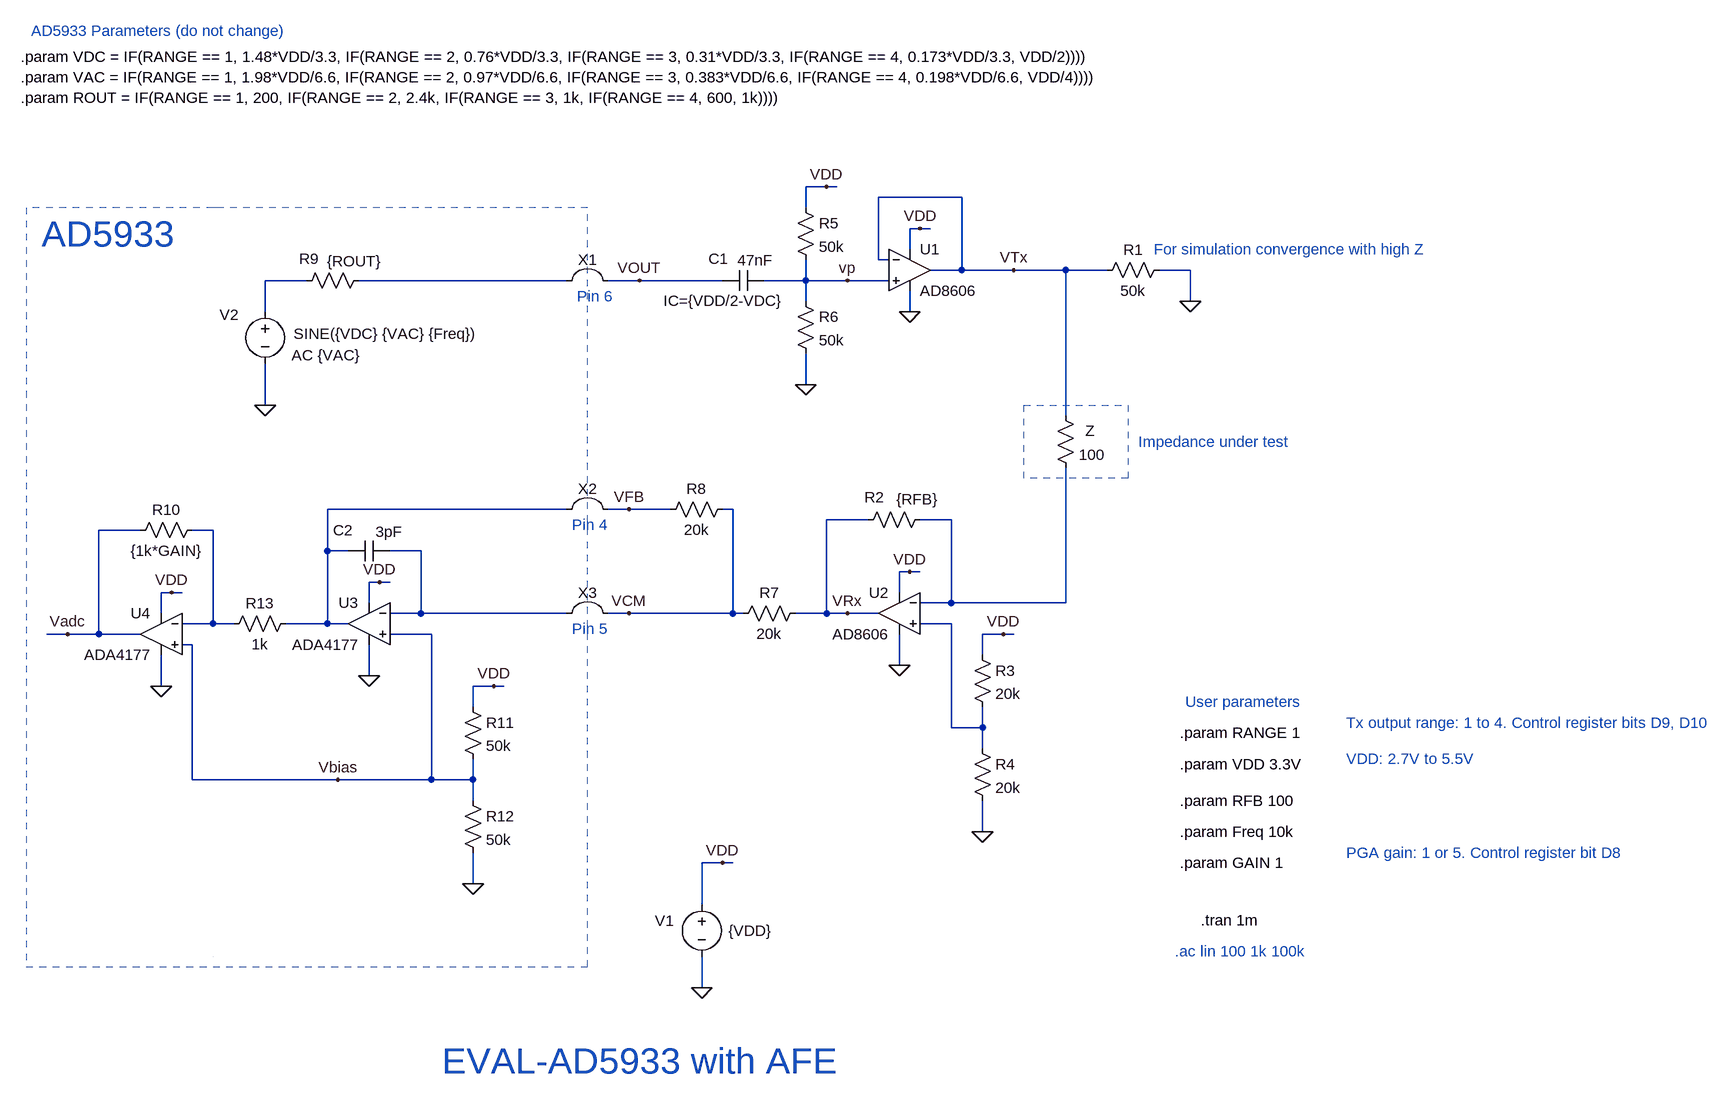
[diagram p0: schematic EVAL-AD5933.asc]
EVAL-AD5933.asc, the LTspice schematic file:
Version 4
SHEET 1 2608 1192
WIRE 80 -208 48 -208
WIRE 96 -208 80 -208
WIRE 288 -192 160 -192
WIRE 48 -176 48 -208
WIRE 224 -144 208 -144
WIRE 240 -144 224 -144
WIRE 208 -112 208 -144
WIRE 160 -96 160 -192
WIRE 176 -96 160 -96
WIRE 288 -80 288 -192
WIRE 288 -80 240 -80
WIRE 368 -80 288 -80
WIRE 448 -80 368 -80
WIRE 512 -80 448 -80
WIRE 640 -80 592 -80
WIRE -720 -64 -784 -64
WIRE -320 -64 -640 -64
WIRE -208 -64 -256 -64
WIRE -80 -64 -208 -64
WIRE 48 -64 48 -96
WIRE 48 -64 -16 -64
WIRE 112 -64 48 -64
WIRE 176 -64 112 -64
WIRE 48 -32 48 -64
WIRE 640 -32 640 -80
WIRE -784 -16 -784 -64
WIRE 208 -16 208 -48
WIRE 48 96 48 48
WIRE -784 128 -784 64
WIRE 448 144 448 -80
WIRE -320 288 -688 288
WIRE -224 288 -256 288
WIRE -160 288 -224 288
WIRE -64 288 -80 288
WIRE 144 304 80 304
WIRE 272 304 224 304
WIRE -976 320 -1040 320
WIRE -864 320 -896 320
WIRE -688 352 -688 288
WIRE -656 352 -688 352
WIRE -544 352 -592 352
WIRE 208 384 192 384
WIRE 224 384 208 384
WIRE -608 400 -624 400
WIRE -592 400 -608 400
WIRE -928 416 -944 416
WIRE -912 416 -928 416
WIRE 192 416 192 384
WIRE -624 432 -624 400
WIRE 272 432 272 304
WIRE 272 432 224 432
WIRE 448 432 448 224
WIRE 448 432 272 432
WIRE -944 448 -944 416
WIRE -544 448 -544 352
WIRE -544 448 -592 448
WIRE -320 448 -544 448
WIRE -224 448 -256 448
WIRE -64 448 -64 288
WIRE -64 448 -224 448
WIRE -48 448 -64 448
WIRE 80 448 80 304
WIRE 80 448 32 448
WIRE 112 448 80 448
WIRE 160 448 112 448
WIRE -864 464 -864 320
WIRE -864 464 -912 464
WIRE -832 464 -864 464
WIRE -688 464 -688 352
WIRE -688 464 -752 464
WIRE -656 464 -688 464
WIRE 272 464 224 464
WIRE -1088 480 -1120 480
WIRE -1040 480 -1040 320
WIRE -1040 480 -1088 480
WIRE -976 480 -1040 480
WIRE -528 480 -592 480
WIRE 352 480 320 480
WIRE 368 480 352 480
WIRE -896 496 -912 496
WIRE 320 512 320 480
WIRE 192 528 192 480
WIRE -624 544 -624 496
WIRE -944 560 -944 512
WIRE -432 560 -464 560
WIRE -416 560 -432 560
WIRE -464 592 -464 560
WIRE 272 624 272 464
WIRE 320 624 320 592
WIRE 320 624 272 624
WIRE 320 656 320 624
WIRE -896 704 -896 496
WIRE -672 704 -896 704
WIRE -528 704 -528 480
WIRE -528 704 -672 704
WIRE -464 704 -464 672
WIRE -464 704 -528 704
WIRE -464 736 -464 704
WIRE 320 784 320 736
WIRE -80 832 -112 832
WIRE -64 832 -80 832
WIRE -464 864 -464 816
WIRE -112 896 -112 832
WIRE -112 1024 -112 976
FLAG -112 1024 0
FLAG -80 832 VDD
FLAG 208 -16 0
FLAG 192 528 0
FLAG 224 -144 VDD
FLAG 208 384 VDD
FLAG 320 784 0
FLAG 352 480 VDD
FLAG 48 96 0
FLAG 80 -208 VDD
FLAG -208 -64 VOUT
FLAG -224 288 VFB
FLAG -224 448 VCM
FLAG -784 128 0
FLAG -464 864 0
FLAG -432 560 VDD
FLAG -608 400 VDD
FLAG -624 544 0
FLAG 112 -64 vp
FLAG -1088 480 Vadc
FLAG -928 416 VDD
FLAG -944 560 0
FLAG -672 704 Vbias
FLAG 368 -80 VTx
FLAG 112 448 VRx
FLAG 640 -32 0
SYMBOL OpAmps\\AD8606 208 -144 R0
SYMATTR InstName U1
SYMBOL OpAmps\\AD8606 192 384 M0
SYMATTR InstName U2
SYMBOL voltage -112 880 R0
WINDOW 0 -72 41 Left 2
WINDOW 3 41 56 Left 2
WINDOW 123 0 0 Left 0
WINDOW 39 0 0 Left 0
SYMATTR InstName V1
SYMATTR Value {VDD}
SYMBOL res 432 128 R0
WINDOW 0 46 39 Left 2
SYMATTR InstName Z
SYMATTR Value 100
SYMBOL res 240 288 R90
WINDOW 0 -3 86 VBottom 2
WINDOW 3 -31 20 VTop 2
SYMATTR InstName R2
SYMATTR Value {RFB}
SYMBOL res 304 496 R0
SYMATTR InstName R3
SYMATTR Value 20k
SYMBOL res 304 640 R0
SYMATTR InstName R4
SYMATTR Value 20k
SYMBOL cap -16 -80 R90
WINDOW 0 -2 70 VBottom 2
WINDOW 3 -31 13 VTop 2
WINDOW 39 63 63 VBottom 2
SYMATTR InstName C1
SYMATTR Value 47nF
SYMATTR SpiceLine IC={VDD/2-VDC}
SYMBOL res 32 -192 R0
SYMATTR InstName R5
SYMATTR Value 50k
SYMBOL res 32 -48 R0
SYMATTR InstName R6
SYMATTR Value 50k
SYMBOL res 48 432 R90
WINDOW 0 0 56 VBottom 2
WINDOW 3 32 56 VTop 2
SYMATTR InstName R7
SYMATTR Value 20k
SYMBOL res -64 272 R90
WINDOW 0 0 56 VBottom 2
WINDOW 3 32 56 VTop 2
SYMATTR InstName R8
SYMATTR Value 20k
SYMBOL Misc\\jumper -288 -128 R0
SYMATTR InstName X1
SYMBOL Misc\\jumper -288 224 R0
SYMATTR InstName X2
SYMBOL Misc\\jumper -288 384 R0
SYMATTR InstName X3
SYMBOL voltage -784 -32 R0
WINDOW 0 -70 21 Left 2
WINDOW 3 44 50 Left 2
WINDOW 123 41 83 Left 2
WINDOW 39 0 0 Left 0
SYMATTR InstName V2
SYMATTR Value SINE({VDC} {VAC} {Freq})
SYMATTR Value2 AC {VAC}
SYMBOL res -624 -80 R90
WINDOW 0 -2 92 VBottom 2
WINDOW 3 -29 22 VTop 2
SYMATTR InstName R9
SYMATTR Value {ROUT}
SYMBOL cap -592 336 R90
WINDOW 0 0 72 VBottom 2
WINDOW 3 -29 1 VTop 2
SYMATTR InstName C2
SYMATTR Value 3pF
SYMBOL res -480 576 R0
SYMATTR InstName R11
SYMATTR Value 50k
SYMBOL res -480 720 R0
SYMATTR InstName R12
SYMATTR Value 50k
SYMBOL OpAmps\\ADA4177 -624 464 M0
SYMATTR InstName U3
SYMBOL OpAmps\\ADA4177 -944 480 M0
SYMATTR InstName U4
SYMBOL res -880 304 R90
WINDOW 0 0 56 VBottom 2
WINDOW 3 32 56 VTop 2
SYMATTR InstName R10
SYMATTR Value {1k*GAIN}
SYMBOL res -736 448 R90
WINDOW 0 0 56 VBottom 2
WINDOW 3 32 56 VTop 2
SYMATTR InstName R13
SYMATTR Value 1k
SYMBOL res 608 -96 R90
WINDOW 0 0 56 VBottom 2
WINDOW 3 32 56 VTop 2
SYMATTR InstName R1
SYMATTR Value 50k
TEXT 624 632 Left 2 !.param RANGE 1
TEXT -1160 -408 Left 2 !.param VDC = IF(RANGE == 1, 1.48*VDD/3.3, IF(RANGE == 2, 0.76*VDD/3.3, IF(RANGE == 3, 0.31*VDD/3.3, IF(RANGE == 4, 0.173*VDD/3.3, VDD/2))))\n.param VAC = IF(RANGE == 1, 1.98*VDD/6.6, IF(RANGE == 2, 0.97*VDD/6.6, IF(RANGE == 3, 0.383*VDD/6.6, IF(RANGE == 4, 0.198*VDD/6.6, VDD/4))))\n.param ROUT = IF(RANGE == 1, 200, IF(RANGE == 2, 2.4k, IF(RANGE == 3, 1k, IF(RANGE == 4, 600, 1k))))
TEXT 624 680 Left 2 !.param VDD 3.3V
TEXT 624 736 Left 2 !.param RFB 100
TEXT 624 784 Left 2 !.param Freq 10k
TEXT 656 920 Left 2 !.tran 1m
TEXT -1128 -136 Left 5 ;AD5933
TEXT 624 832 Left 2 !.param GAIN 1
TEXT 584 -112 Left 2 ;For simulation convergence with high Z
TEXT 632 584 Left 2 ;User parameters
TEXT -1144 -448 Left 2 ;AD5933 Parameters (do not change)
TEXT -512 1136 Left 5 ;EVAL-AD5933 with AFE
TEXT 616 968 Left 2 ;.ac lin 100 1k 100k
TEXT 880 816 Left 2 ;PGA gain: 1 or 5. Control register bit D8
TEXT 880 616 Left 2 ;Tx output range: 1 to 4. Control register bits D9, D10
TEXT 880 672 Left 2 ;VDD: 2.7V to 5.5V
TEXT 560 184 Left 2 ;Impedance under test
TEXT -312 312 Left 2 ;Pin 4
TEXT -312 472 Left 2 ;Pin 5
TEXT -304 -40 Left 2 ;Pin 6
LINE Normal -288 992 -288 -176 2
LINE Normal -288 -176 -848 -176 2
LINE Normal -288 -176 -288 -176 2
LINE Normal -864 992 -288 992 2
LINE Normal -864 976 -864 976 2
LINE Normal -864 976 -864 976 2
LINE Normal -1152 -176 -1152 992 2
LINE Normal -848 -176 -864 -176 2
LINE Normal -848 -176 -848 -176 2
LINE Normal -1152 992 -864 992 2
LINE Normal -1152 -176 -1152 992 2
LINE Normal -864 -176 -1152 -176 2
RECTANGLE Normal 544 240 384 128 2

The netlist it stands for:
* EVAL-AD5933.asc
XU1 vp VTx VDD 0 VTx AD8606  ; pins In+ In- V+ V- OUT
XU2 N004 N002 VDD 0 VRx AD8606  ; pins In+ In- V+ V- OUT
V1 VDD 0 {VDD}
R§Z VTx N002 100
R2 N002 VRx {RFB}
R3 VDD N004 20k
R4 N004 0 20k
C1 vp VOUT 47nF IC={VDD/2-VDC}
R5 VDD vp 50k
R6 vp 0 50k
R7 VRx VCM 20k
R8 VCM VFB 20k
V2 N001 0 SINE({VDC} {VAC} {Freq}) AC {VAC}
R9 VOUT N001 {ROUT}
C2 VCM VFB 3pF
R11 VDD Vbias 50k
R12 Vbias 0 50k
* U3: ADA4177 (symbol OpAmps\ADA4177 not available, pins judged from their places): In+=Vbias In-=VCM V+=VDD V-=0 OUT=VFB
* U4: ADA4177 (symbol OpAmps\ADA4177 not available, pins judged from their places): In+=Vbias In-=N003 V+=VDD V-=0 OUT=Vadc
R10 N003 Vadc {1k*GAIN}
R13 VFB N003 1k
R1 0 VTx 50k
.param RANGE 1
.param VDC = IF(RANGE == 1, 1.48*VDD/3.3, IF(RANGE == 2, 0.76*VDD/3.3, IF(RANGE == 3, 0.31*VDD/3.3, IF(RANGE == 4, 0.173*VDD/3.3, VDD/2))))
.param VAC = IF(RANGE == 1, 1.98*VDD/6.6, IF(RANGE == 2, 0.97*VDD/6.6, IF(RANGE == 3, 0.383*VDD/6.6, IF(RANGE == 4, 0.198*VDD/6.6, VDD/4))))
.param ROUT = IF(RANGE == 1, 200, IF(RANGE == 2, 2.4k, IF(RANGE == 3, 1k, IF(RANGE == 4, 600, 1k))))
.param VDD 3.3V
.param RFB 100
.param Freq 10k
.tran 1m
* AD5933
.param GAIN 1
* For simulation convergence with high Z
* User parameters
* AD5933 Parameters (do not change)
* EVAL-AD5933 with AFE
* .ac lin 100 1k 100k
* PGA gain: 1 or 5. Control register bit D8
* Tx output range: 1 to 4. Control register bits D9, D10
* VDD: 2.7V to 5.5V
* Impedance under test
* Pin 4
* Pin 5
* Pin 6
.lib ADI.lib
.backanno
.end